# EasyEDA schematic SCH_Szachy_2025-08-29.json
TITLE: Szachy; REV: 1.0; Date: 2025-08-29; Sheet: 1/1; Company: KN ALGO
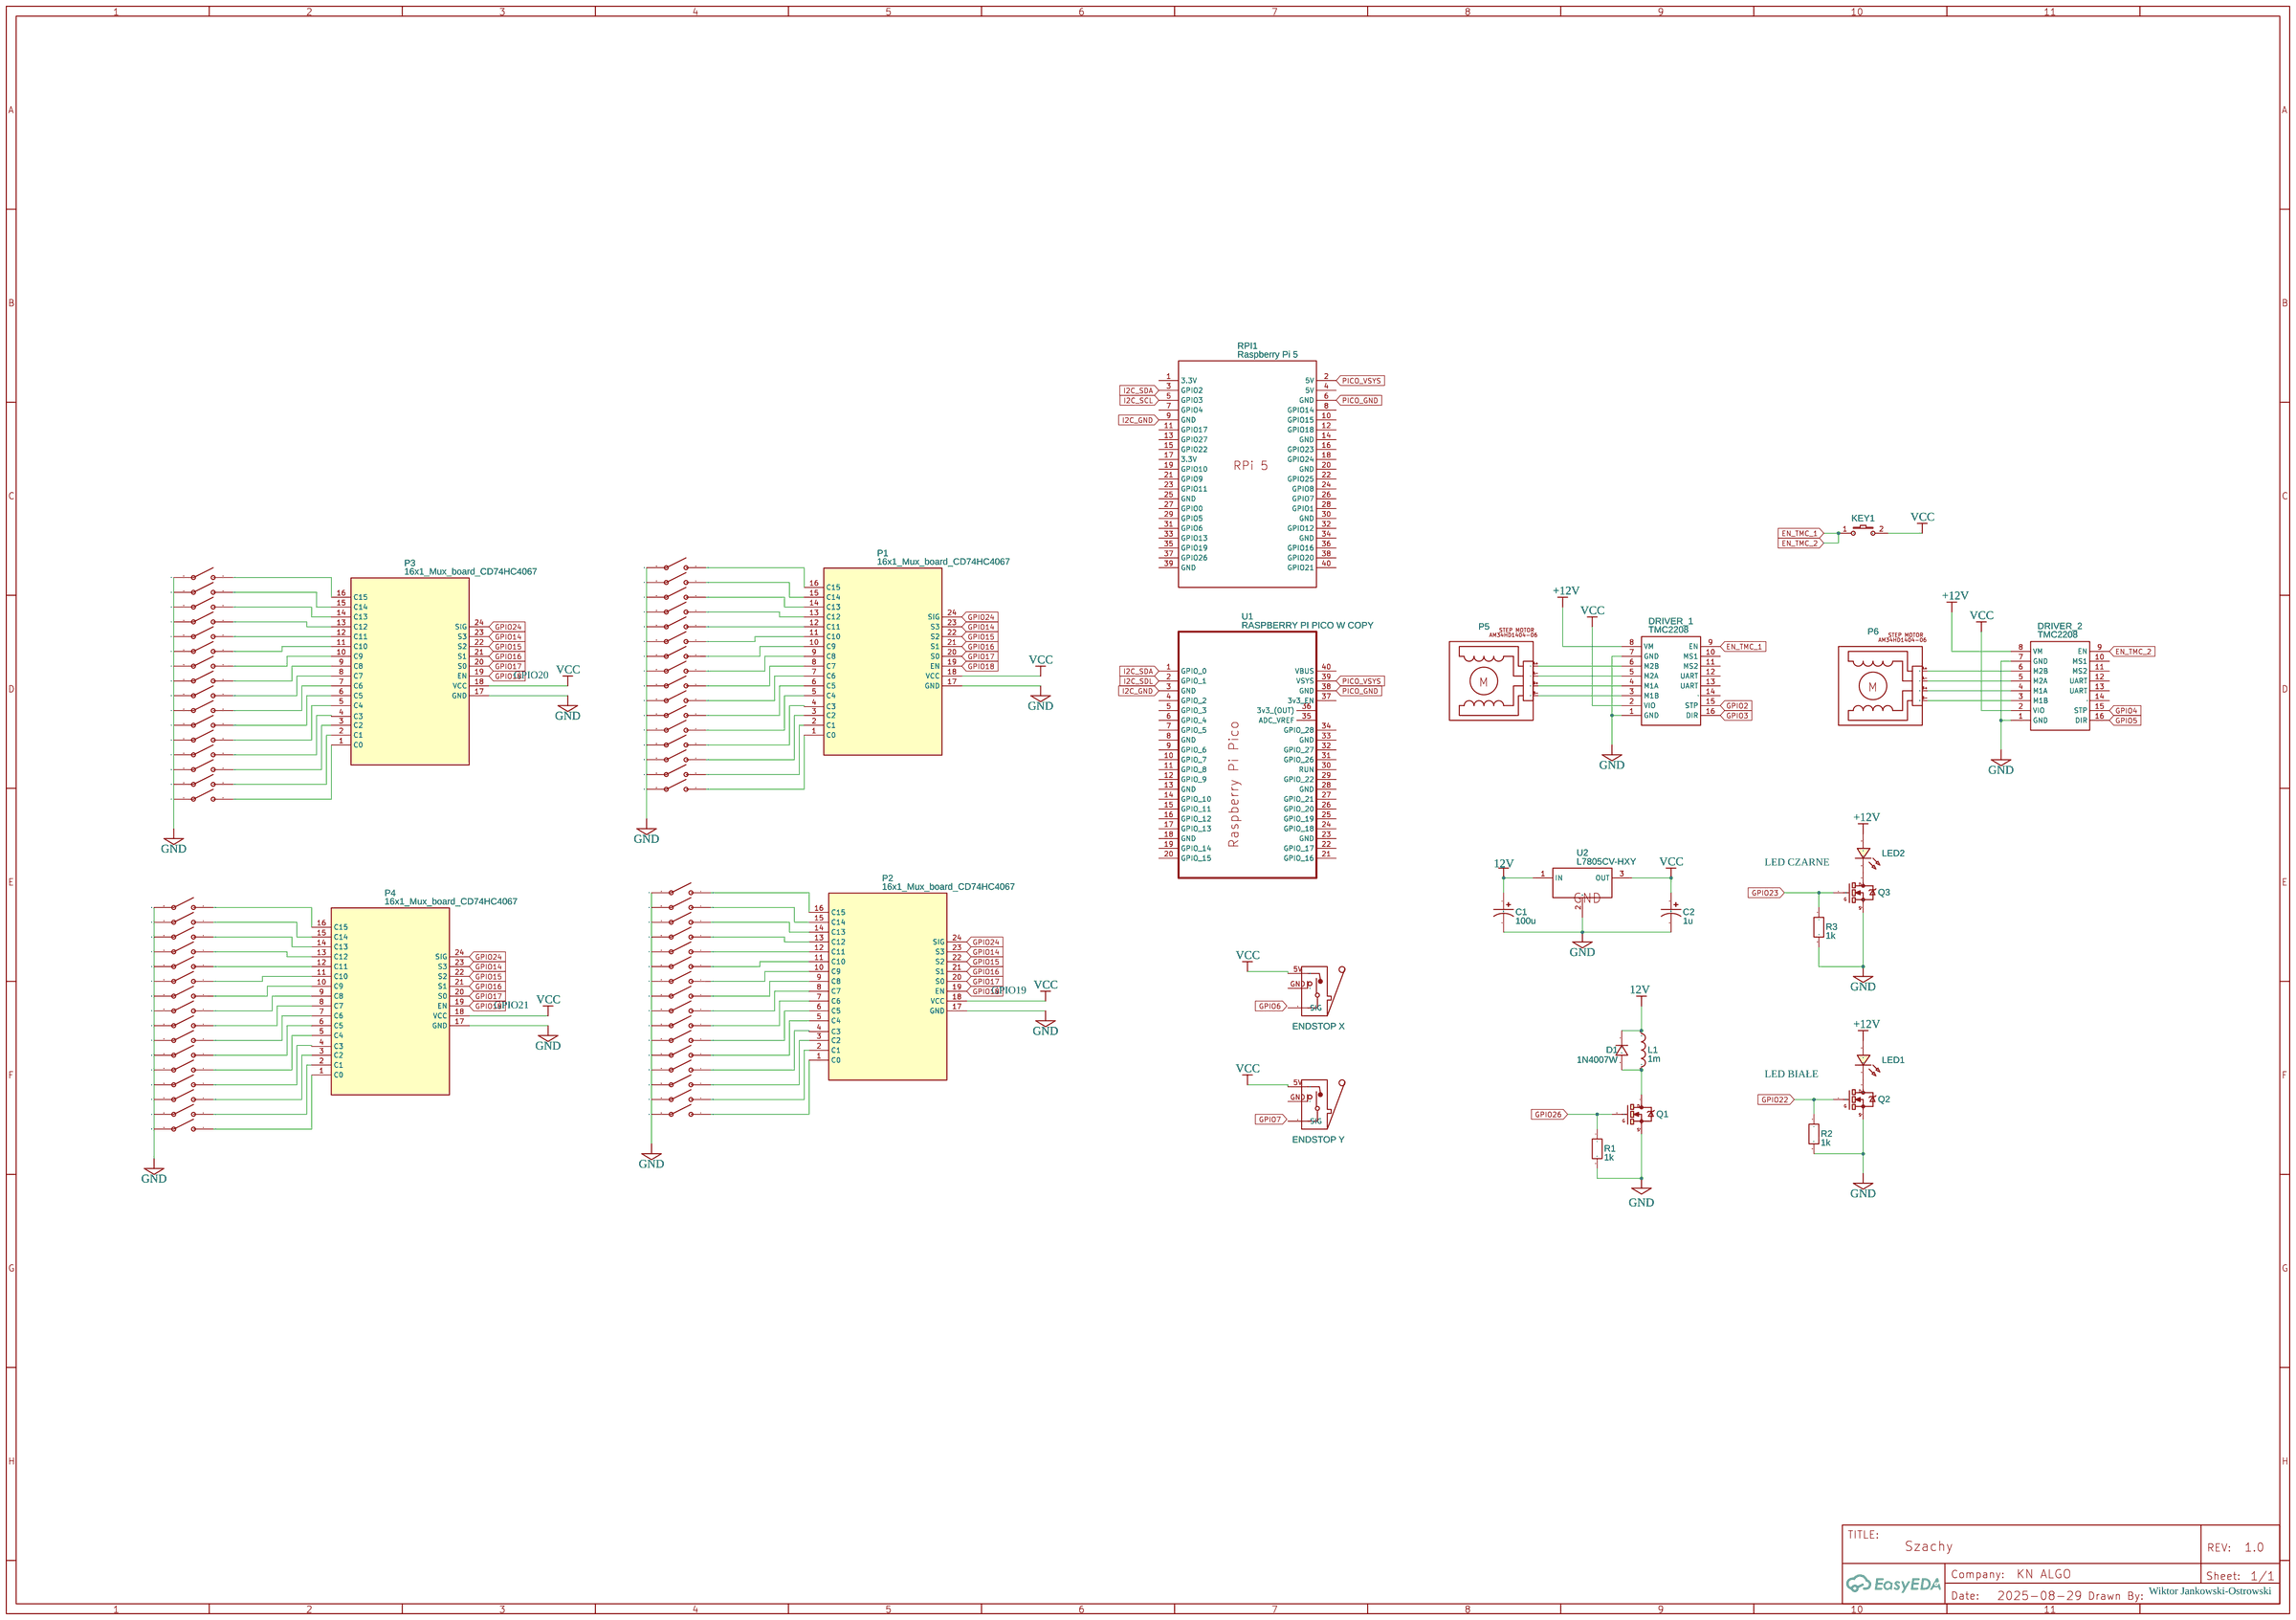
[diagram p0: schematic sheet]

## Parts
C1  100u  [CASE-A_3216]
C2  1u  [CASE-A_3216]
D1  1N4007W  [SOD-123_L2.8-W1.8-LS3.7-RD]
DIP1  switch1  [DIP SWITCH 6 SWITCHES]
DIP2  switch1  [DIP SWITCH 6 SWITCHES]
DIP3  switch1  [DIP SWITCH 6 SWITCHES]
DIP4  switch1  [DIP SWITCH 6 SWITCHES]
DIP5  switch1  [DIP SWITCH 6 SWITCHES]
DIP6  switch1  [DIP SWITCH 6 SWITCHES]
DIP7  switch1  [DIP SWITCH 6 SWITCHES]
DIP8  switch1  [DIP SWITCH 6 SWITCHES]
DIP9  switch1  [DIP SWITCH 6 SWITCHES]
DIP10  switch1  [DIP SWITCH 6 SWITCHES]
DIP11  switch1  [DIP SWITCH 6 SWITCHES]
DIP12  switch1  [DIP SWITCH 6 SWITCHES]
DIP13  switch1  [DIP SWITCH 6 SWITCHES]
DIP14  switch1  [DIP SWITCH 6 SWITCHES]
DIP15  switch1  [DIP SWITCH 6 SWITCHES]
DIP16  switch1  [DIP SWITCH 6 SWITCHES]
DIP17  switch1  [DIP SWITCH 6 SWITCHES]
DIP18  switch1  [DIP SWITCH 6 SWITCHES]
DIP19  switch1  [DIP SWITCH 6 SWITCHES]
DIP20  switch1  [DIP SWITCH 6 SWITCHES]
DIP21  switch1  [DIP SWITCH 6 SWITCHES]
DIP22  switch1  [DIP SWITCH 6 SWITCHES]
DIP23  switch1  [DIP SWITCH 6 SWITCHES]
DIP24  switch1  [DIP SWITCH 6 SWITCHES]
DIP25  switch1  [DIP SWITCH 6 SWITCHES]
DIP26  switch1  [DIP SWITCH 6 SWITCHES]
DIP27  switch1  [DIP SWITCH 6 SWITCHES]
DIP28  switch1  [DIP SWITCH 6 SWITCHES]
DIP29  switch1  [DIP SWITCH 6 SWITCHES]
DIP30  switch1  [DIP SWITCH 6 SWITCHES]
DIP31  switch1  [DIP SWITCH 6 SWITCHES]
DIP32  switch1  [DIP SWITCH 6 SWITCHES]
DIP33  switch1  [DIP SWITCH 6 SWITCHES]
DIP34  switch1  [DIP SWITCH 6 SWITCHES]
DIP35  switch1  [DIP SWITCH 6 SWITCHES]
DIP36  switch1  [DIP SWITCH 6 SWITCHES]
DIP37  switch1  [DIP SWITCH 6 SWITCHES]
DIP38  switch1  [DIP SWITCH 6 SWITCHES]
DIP39  switch1  [DIP SWITCH 6 SWITCHES]
DIP40  switch1  [DIP SWITCH 6 SWITCHES]
DIP41  switch1  [DIP SWITCH 6 SWITCHES]
DIP42  switch1  [DIP SWITCH 6 SWITCHES]
DIP43  switch1  [DIP SWITCH 6 SWITCHES]
DIP44  switch1  [DIP SWITCH 6 SWITCHES]
DIP45  switch1  [DIP SWITCH 6 SWITCHES]
DIP46  switch1  [DIP SWITCH 6 SWITCHES]
DIP47  switch1  [DIP SWITCH 6 SWITCHES]
DIP48  switch1  [DIP SWITCH 6 SWITCHES]
DIP49  switch1  [DIP SWITCH 6 SWITCHES]
DIP50  switch1  [DIP SWITCH 6 SWITCHES]
DIP51  switch1  [DIP SWITCH 6 SWITCHES]
DIP52  switch1  [DIP SWITCH 6 SWITCHES]
DIP53  switch1  [DIP SWITCH 6 SWITCHES]
DIP54  switch1  [DIP SWITCH 6 SWITCHES]
DIP55  switch1  [DIP SWITCH 6 SWITCHES]
DIP56  switch1  [DIP SWITCH 6 SWITCHES]
DIP57  switch1  [DIP SWITCH 6 SWITCHES]
DIP58  switch1  [DIP SWITCH 6 SWITCHES]
DIP59  switch1  [DIP SWITCH 6 SWITCHES]
DIP60  switch1  [DIP SWITCH 6 SWITCHES]
DIP61  switch1  [DIP SWITCH 6 SWITCHES]
DIP62  switch1  [DIP SWITCH 6 SWITCHES]
DIP63  switch1  [DIP SWITCH 6 SWITCHES]
DIP64  switch1  [DIP SWITCH 6 SWITCHES]
DRIVER_1  TMC2208  [TMC2208]
DRIVER_2  TMC2208  [TMC2208]
ESTP_FU1  ENDSTOP X  [ENDSTOP]
ESTP_FU2  ENDSTOP Y  [ENDSTOP]
KEY1  K2-3.6×6.1_SMD  [KEY-SMD_2P-L6.2-W3.6-LS8.0]
L1  1m  [L0603]
LED1  LED-0603_R  [LED0603_RED]
LED2  LED-0603_R  [LED0603_RED]
P1  16x1_Mux_board_CD74HC4067  [CD74HC4067]
P2  16x1_Mux_board_CD74HC4067  [CD74HC4067]
P3  16x1_Mux_board_CD74HC4067  [CD74HC4067]
P4  16x1_Mux_board_CD74HC4067  [CD74HC4067]
P5  STEPPER MOTOR AM34HD1404-06  [SOCKET FOR L9110S-H-BRIDGE-STEPPER-MOTOR-DUAL-DC-MOTOR-DRIVER-CONTROLLER-MODULE]
P6  STEPPER MOTOR AM34HD1404-06  [SOCKET FOR L9110S-H-BRIDGE-STEPPER-MOTOR-DUAL-DC-MOTOR-DRIVER-CONTROLLER-MODULE]
Q1  MOSFET-NCHANNELFDD8780  [DPAK]
Q2  MOSFET-NCHANNELFDD8780  [DPAK]
Q3  MOSFET-NCHANNELFDD8780  [DPAK]
R1  1k  [R0603]
R2  1k  [R0603]
R3  1k  [R0603]
RPI1  Raspberry Pi 5  [HDR-20X2/2.54]
U1  RASPBERRY PI PICO W COPY  [RASPBERRY PI PICO/ RASPBERRY PI PICO W]
U2  L7805CV-HXY  [TO-220-3_L10.0-W4.5-P2.54-L]

## Library data of the parts
C1 C2 = C_Tan_SMD_A_US: Contributor: LCEDA_Lib
D1 = 1N4007W: Supplier: LCSC; Supplier Part: C328592; Manufacturer: BLUE ROCKET; Contributor: LCEDA_Lib
DIP1-DIP64 = switch1: Manufacturer: DIP; Manufacturer Part: DIP switchEI-08; Supplier Part: C90019; Contributor: nataliafrias; libConvert: Yes; Add into BOM: Yes
DRIVER_1 DRIVER_2 = TMC2208: Contributor: phutran31012002
ESTP_FU1 ESTP_FU2 = EndStop: Contributor: ngtuankiet.2212; Supplier: MAKERBASE
KEY1 = K2-3.6×6.1_SMD: Supplier Part: C118141; Supplier: LCSC; Manufacturer Part: K2-1107ST-A4SW-06; Contributor: LCEDA_Lib; 制造商: 韩国韩荣
L1 = L0603_US: Contributor: LCEDA_Lib
LED1 LED2 = LED-0603_R: Manufacturer: EVERLIGHT(台湾亿光); Manufacturer Part: 19-217/R6C-AL1M2VY/3T; Supplier Part: C72044; Supplier: LCSC; Contributor: LCEDA_01
P1-P4 = 16x1_Mux_board_CD74HC4067: sourceId: 1T5FDZYC8; Contributor: sudeep banik
P5 P6 = STEPPER MOTOR AM34HD1404-06: Supplier Part: C37208; Manufacturer: BOOMELE; Manufacturer Part: Header-Male-2.54_1x6; Contributor: ethanol70
Q1-Q3 = MOSFET-NCHANNELFDD8780: Common NMOSFET Parts; Contributor: SparkFun
R1-R3 = R_0603_EU: Contributor: LCEDA_Lib
RPI1 = Raspberry Pi 5: Contributor: lav4; Manufacturer: Raspberry Pi 5 4GB
U1 = RASPBERRY PI PICO W COPY: Contributor: timothe.etique
U2 = L7805CV-HXY: Contributor: lcsc; Supplier: LCSC; Supplier Part: C7469132; Manufacturer: HXY MOSFET(华轩阳电子); JLCPCB Part Class: Extended Part

## Nets
12V: C1.1 D1.1 L1.1 U2.1(IN)
+12V: DRIVER_1.8(VM) DRIVER_2.8(VM) LED1.1 LED2.1
GND: C1.2 C2.2 DRIVER_1.1(GND) DRIVER_1.7(GND) DRIVER_2.1(GND) DRIVER_2.7(GND) P1.17(GND) P2.17(GND) P3.17(GND) P4.17(GND) Q1.3(S) Q2.3(S) Q3.3(S) R1.2 R2.2 R3.2 U2.2(GND)
VCC: C2.1 DRIVER_1.2(VIO) DRIVER_2.2(VIO) ESTP_FU1.5V(2) ESTP_FU2.5V(2) KEY1.2 P1.18(VCC) P2.18(VCC) P3.18(VCC) P4.18(VCC) U2.3(OUT)
EN_TMC_1: DRIVER_1.9(EN) DRIVER_2.9(EN) KEY1.1
GPIO2: DRIVER_1.15(STP)
GPIO3: DRIVER_1.16(DIR)
GPIO4: DRIVER_2.15(STP)
GPIO5: DRIVER_2.16(DIR)
GPIO14: P1.23(S3) P2.23(S3) P3.23(S3) P4.23(S3)
GPIO15: P1.22(S2) P2.22(S2) P3.22(S2) P4.22(S2)
GPIO16: P1.21(S1) P2.21(S1) P3.21(S1) P4.21(S1)
GPIO17: P1.20(S0) P2.20(S0) P3.20(S0) P4.20(S0)
GPIO18: P1.19(EN) P2.19(EN) P3.19(EN) P4.19(EN)
GPIO22: Q2.1(G) R2.1
GPIO23: Q3.1(G) R3.1
GPIO24: P1.24(SIG) P2.24(SIG) P3.24(SIG) P4.24(SIG)
GPIO26: Q1.1(G) R1.1
I2C_GND: RPI1.9(GND) U1.3(GND)
I2C_SCL: RPI1.5(GPIO3)
I2C_SDA: RPI1.3(GPIO2) U1.1(GPIO 0)
I2C_SDL: U1.2(GPIO 1)
PICO_GND: RPI1.6(GND) U1.38(GND)
PICO_VSYS: RPI1.2(5V) U1.39(VSYS)
Net-(D1-2): D1.2 L1.2 Q1.4(D)
Net-(DRIVER_1-3): DRIVER_1.3(M1B) P5.B-
Net-(DRIVER_1-4): DRIVER_1.4(M1A) P5.B+
Net-(DRIVER_1-5): DRIVER_1.5(M2A) P5.A-
Net-(DRIVER_1-6): DRIVER_1.6(M2B) P5.A+
Net-(DRIVER_2-3): DRIVER_2.3(M1B) P6.B-
Net-(DRIVER_2-4): DRIVER_2.4(M1A) P6.B+
Net-(DRIVER_2-5): DRIVER_2.5(M2A) P6.A-
Net-(DRIVER_2-6): DRIVER_2.6(M2B) P6.A+
Net-(LED1-2): LED1.2 Q2.4(D)
Net-(LED2-2): LED2.2 Q3.4(D)

Not connected (* = marked no-connect by the designer): DIP1 1 2; DIP2 1 2; DIP3 1 2; DIP4 1 2; DIP5 1 2; DIP6 1 2; DIP7 1 2; DIP8 1 2; DIP9 1 2; DIP10 1 2; DIP11 1 2; DIP12 1 2; DIP13 1 2; DIP14 1 2; DIP15 1 2; DIP16 1 2; DIP17 1 2; DIP18 1 2; DIP19 1 2; DIP20 1 2; DIP21 1 2; DIP22 1 2; DIP23 1 2; DIP24 1 2; DIP25 1 2; DIP26 1 2; DIP27 1 2; DIP28 1 2; DIP29 1 2; DIP30 1 2; DIP31 1 2; DIP32 1 2; DIP33 1 2; DIP34 1 2; DIP35 1 2; DIP36 1 2; DIP37 1 2; DIP38 1 2; DIP39 1 2; DIP40 1 2; DIP41 1 2; DIP42 1 2; DIP43 1 2; DIP44 1 2; DIP45 1 2; DIP46 1 2; DIP47 1 2; DIP48 1 2; DIP49 1 2; DIP50 1 2; DIP51 1 2; DIP52 1 2; DIP53 1 2; DIP54 1 2; DIP55 1 2; DIP56 1 2; DIP57 1 2; DIP58 1 2; DIP59 1 2; DIP60 1 2; DIP61 1 2; DIP62 1 2; DIP63 1 2; DIP64 1 2; DRIVER_1 10(MS1) 11(MS2) 12(UART) 13(UART) 14(6); DRIVER_2 10(MS1) 11(MS2) 12(UART) 13(UART) 14(6); ESTP_FU1 1(SIG) GND(3); ESTP_FU2 1(SIG) GND(3); P1 1(C0) 2(C1) 3(C2) 4(C3) 5(C4) 6(C5) 7(C6) 8(C7) 9(C8) 10(C9) 11(C10) 12(C11) 13(C12) 14(C13) 15(C14) 16(C15); P2 1(C0) 2(C1) 3(C2) 4(C3) 5(C4) 6(C5) 7(C6) 8(C7) 9(C8) 10(C9) 11(C10) 12(C11) 13(C12) 14(C13) 15(C14) 16(C15); P3 1(C0) 2(C1) 3(C2) 4(C3) 5(C4) 6(C5) 7(C6) 8(C7) 9(C8) 10(C9) 11(C10) 12(C11) 13(C12) 14(C13) 15(C14) 16(C15); P4 1(C0) 2(C1) 3(C2) 4(C3) 5(C4) 6(C5) 7(C6) 8(C7) 9(C8) 10(C9) 11(C10) 12(C11) 13(C12) 14(C13) 15(C14) 16(C15); RPI1 1(3.3V) 4(5V) 7(GPIO4) 8(GPIO14) 10(GPIO15) 11(GPIO17) 12(GPIO18) 13(GPIO27) 14(GND) 15(GPIO22) 16(GPIO23) 17(3.3V) 18(GPIO24) 19(GPIO10) 20(GND) 21(GPIO9) 22(GPIO25) 23(GPIO11) 24(GPIO8) 25(GND) 26(GPIO7) 27(GPIO0) 28(GPIO1) 29(GPIO5) 30(GND) 31(GPIO6) 32(GPIO12) 33(GPIO13) 34(GND) 35(GPIO19) 36(GPIO16) 37(GPIO26) 38(GPIO20) 39(GND) 40(GPIO21); U1 4(GPIO 2) 5(GPIO 3) 6(GPIO 4) 7(GPIO 5) 8(GND) 9(GPIO 6) 10(GPIO 7) 11(GPIO 8) 12(GPIO 9) 13(GND) 14(GPIO 10) 15(GPIO 11) 16(GPIO 12) 17(GPIO 13) 18(GND) 19(GPIO 14) 20(GPIO 15) 21(GPIO 16) 22(GPIO 17) 23(GND) 24(GPIO 18) 25(GPIO 19) 26(GPIO 20) 27(GPIO 21) 28(GND) 29(GPIO 22) 30(RUN) 31(GPIO 26) 32(GPIO 27) 33(GND) 34(GPIO 28) 35(ADC_VREF) 36(3v3 (OUT)) 37(3v3_EN) 40(VBUS)

## Notes on the sheet
- GPIO20
- LED CZARNE
- GPIO19
- GPIO21
- LED BIAŁE
- Wiktor Jankowski-Ostrowski
